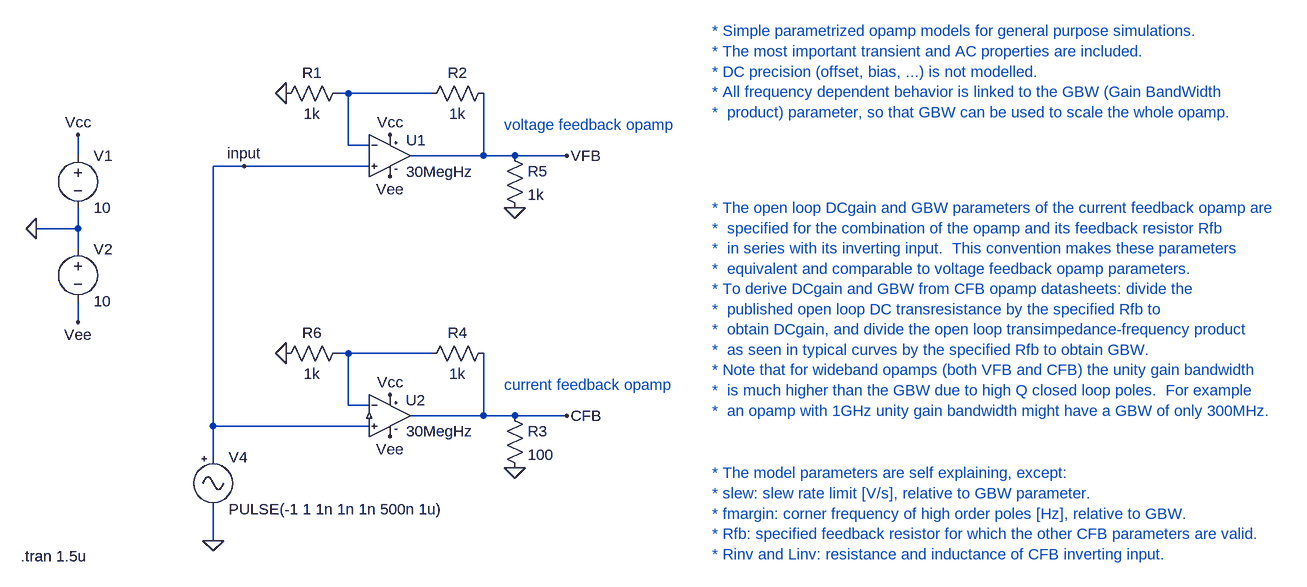
[diagram p0: schematic demo.asc]
demo.asc, the LTspice schematic file:
Version 4
SHEET 1 2444 1116
WIRE 464 64 448 64
WIRE 592 64 464 64
WIRE 464 144 464 64
WIRE 496 144 464 144
WIRE 48 160 48 128
WIRE 672 160 672 64
WIRE 672 160 560 160
WIRE 720 160 672 160
WIRE 800 160 720 160
WIRE 304 176 256 176
WIRE 496 176 304 176
WIRE 48 272 48 240
WIRE 48 272 -16 272
WIRE 48 304 48 272
WIRE 48 416 48 384
WIRE 464 464 448 464
WIRE 592 464 464 464
WIRE 464 544 464 464
WIRE 496 544 464 544
WIRE 672 560 672 464
WIRE 672 560 560 560
WIRE 720 560 672 560
WIRE 800 560 720 560
WIRE 256 576 256 176
WIRE 496 576 256 576
WIRE 256 624 256 576
WIRE 256 752 256 704
FLAG -16 272 0
FLAG 48 128 Vcc
FLAG 48 416 Vee
FLAG 528 128 Vcc
FLAG 528 192 Vee
FLAG 368 64 0
FLAG 256 752 0
FLAG 528 528 Vcc
FLAG 528 592 Vee
FLAG 720 640 0
FLAG 720 240 0
FLAG 368 464 0
FLAG 800 160 VFB
FLAG 800 560 CFB
FLAG 304 176 input
SYMBOL voltage 48 144 R0
WINDOW 123 0 0 Left 0
WINDOW 39 0 0 Left 0
SYMATTR InstName V1
SYMATTR Value 10
SYMBOL voltage 48 288 R0
WINDOW 123 0 0 Left 0
WINDOW 39 0 0 Left 0
SYMATTR InstName V2
SYMATTR Value 10
SYMBOL res 464 48 R90
WINDOW 0 0 56 VBottom 0
WINDOW 3 32 56 VTop 0
SYMATTR InstName R1
SYMATTR Value 1k
SYMBOL res 688 48 R90
WINDOW 0 0 56 VBottom 0
WINDOW 3 32 56 VTop 0
SYMATTR InstName R2
SYMATTR Value 1k
SYMBOL res 688 448 R90
WINDOW 0 0 56 VBottom 0
WINDOW 3 32 56 VTop 0
SYMATTR InstName R4
SYMATTR Value 1k
SYMBOL paramVFBopamp 528 160 R0
SYMATTR InstName U1
SYMATTR Value2 30MegHz
SYMBOL Misc\\signal 256 608 R0
WINDOW 123 0 0 Left 0
WINDOW 39 0 0 Left 0
SYMATTR InstName V4
SYMATTR Value PULSE(-1 1 1n 1n 1n 500n 1u)
SYMBOL res 704 544 R0
SYMATTR InstName R3
SYMATTR Value 100
SYMBOL res 704 144 R0
SYMATTR InstName R5
SYMATTR Value 1k
SYMBOL res 464 448 R90
WINDOW 0 0 56 VBottom 0
WINDOW 3 32 56 VTop 0
SYMATTR InstName R6
SYMATTR Value 1k
SYMBOL paramCFBopamp 528 560 R0
SYMATTR InstName U2
SYMATTR Value2 30MegHz
TEXT -40 776 Left 0 !.tran 1.5u
TEXT 704 112 Left 0 ;voltage feedback opamp
TEXT 704 512 Left 0 ;current feedback opamp
TEXT 1024 648 Left 0 ;* The model parameters are self explaining, except:\n* slew: slew rate limit [V/s], relative to GBW parameter.\n* fmargin: corner frequency of high order poles [Hz], relative to GBW. \n* Rfb: specified feedback resistor for which the other CFB parameters are valid.\n* Rinv and Linv: resistance and inductance of CFB inverting input.
TEXT 1024 240 Left 0 ;* The open loop DCgain and GBW parameters of the current feedback opamp are \n*  specified for the combination of the opamp and its feedback resistor Rfb \n*  in series with its inverting input.  This convention makes these parameters  \n*  equivalent and comparable to voltage feedback opamp parameters.\n* To derive DCgain and GBW from CFB opamp datasheets: divide the \n*  published open loop DC transresistance by the specified Rfb to\n*  obtain DCgain, and divide the open loop transimpedance-frequency product\n*  as seen in typical curves by the specified Rfb to obtain GBW. \n* Note that for wideband opamps (both VFB and CFB) the unity gain bandwidth\n*  is much higher than the GBW due to high Q closed loop poles.  For example\n*  an opamp with 1GHz unity gain bandwidth might have a GBW of only 300MHz.
TEXT 1024 -32 Left 0 ;* Simple parametrized opamp models for general purpose simulations.\n* The most important transient and AC properties are included.\n* DC precision (offset, bias, ...) is not modelled.\n* All frequency dependent behavior is linked to the GBW (Gain BandWidth\n*  product) parameter, so that GBW can be used to scale the whole opamp.

The netlist it stands for:
* demo.asc
V1 Vcc 0 10
V2 0 Vee 10
R1 N001 0 1k
R2 VFB N001 1k
R4 CFB N002 1k
XU1 input N001 Vcc Vee VFB paramVFBopamp DCgain=1e5 fmargin=4 GBW= 30MegHz slew=1 Rout=100 VsatPos=1.5V VsatNeg=1.5V Iq=4mA curlimSource=40mA curlimSink=40mA  ; pins In+ In- V+ V- OUT
V4 input 0 PULSE(-1 1 1n 1n 1n 500n 1u)
R3 CFB 0 100
R5 VFB 0 1k
R6 N002 0 1k
XU2 input N002 Vcc Vee CFB paramCFBopamp DCgain=1e3  Rfb=1k fmargin=3 GBW= 30MegHz Rinv=10 Linv=10n slew=5 Rout=10 VsatPos=1.5V VsatNeg=1.5V Iq=10mA curlimSource=60mA curlimSink=60mA  ; pins In+ In- V+ V- OUT
.tran 1.5u
* voltage feedback opamp
* current feedback opamp
* * The model parameters are self explaining, except:
* * slew: slew rate limit [V/s], relative to GBW parameter.
* * fmargin: corner frequency of high order poles [Hz], relative to GBW.
* * Rfb: specified feedback resistor for which the other CFB parameters are valid.
* * Rinv and Linv: resistance and inductance of CFB inverting input.
* * The open loop DCgain and GBW parameters of the current feedback opamp are
* *  specified for the combination of the opamp and its feedback resistor Rfb
* *  in series with its inverting input.  This convention makes these parameters
* *  equivalent and comparable to voltage feedback opamp parameters.
* * To derive DCgain and GBW from CFB opamp datasheets: divide the
* *  published open loop DC transresistance by the specified Rfb to
* *  obtain DCgain, and divide the open loop transimpedance-frequency product
* *  as seen in typical curves by the specified Rfb to obtain GBW.
* * Note that for wideband opamps (both VFB and CFB) the unity gain bandwidth
* *  is much higher than the GBW due to high Q closed loop poles.  For example
* *  an opamp with 1GHz unity gain bandwidth might have a GBW of only 300MHz.
* * Simple parametrized opamp models for general purpose simulations.
* * The most important transient and AC properties are included.
* * DC precision (offset, bias, ...) is not modelled.
* * All frequency dependent behavior is linked to the GBW (Gain BandWidth
* *  product) parameter, so that GBW can be used to scale the whole opamp.
.lib PARAMopamps.lib
.backanno
.end